# Altium project usb_ir.PRJPCB
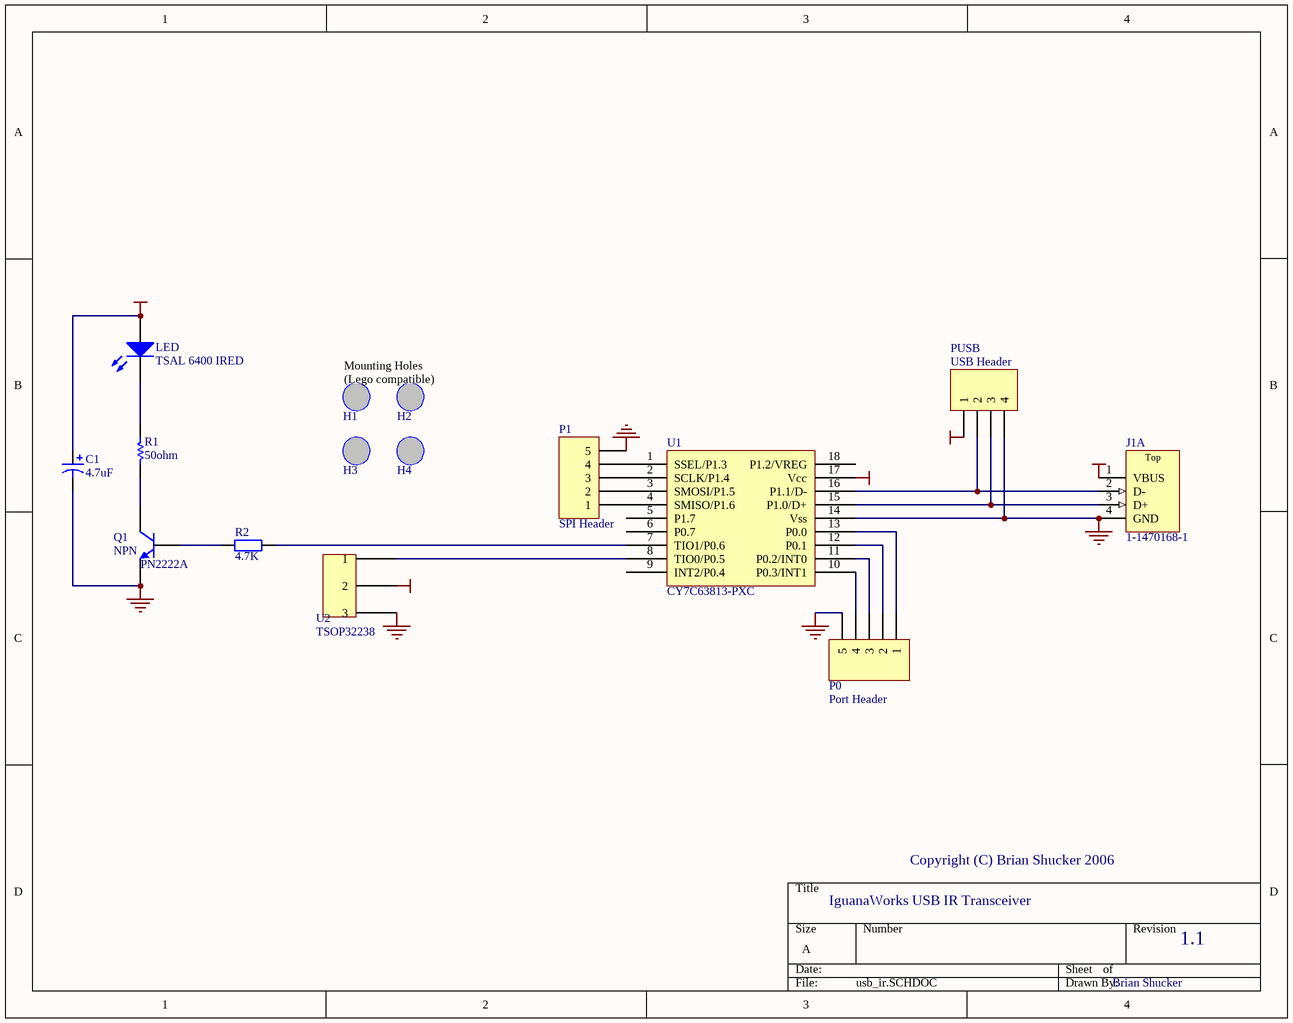
[diagram p0: usb_ir.SCHDOC]
1 sheet, 15 parts. Net scope: global (net labels, ports and power ports of the same name join across sheets).
Board file: usb_ir.PCBDOC

## Sheet usb_ir.SCHDOC
size A

### Parts
C1  value 4.7uF  [CAPPR2-5x6.8]  (hidden comment: Cap Pol1)
H1  Lego Hole  [Lego Hole]  (value not drawn)
H2  Lego Hole  [Lego Hole]  (value not drawn)
H3  Lego Hole  [Lego Hole]  (value not drawn)
H4  Lego Hole  [Lego Hole]  (value not drawn)
J1  1-1470168-1  [1470695A]  (part A of 3)
LED  TSAL 6400 IRED  [LED]
P0  Port Header  [HDR1X5]
P1  SPI Header  [HDR1X5]
PUSB  USB Header  [HDR1X4]
Q1  NPN  [TO-92]
R1  50ohm  [AXIAL-0.4]
R2  value 4.7K  [AXIAL-0.4]  (hidden comment: Res2)
U1  CY7C63813-PXC  [DIP-18]
U2  TSOP32238  [vishay1]

### Nets
GND: C1.2 J1.4(GND) P0.5 P1.5 PUSB.4 Q1.3(E) U1.14(Vss) U2.3
VCC: C1.1 J1.1(VBUS) LED.1(A) PUSB.1 U1.17(Vcc) U2.2
NetJ1_2: J1.2(D-) PUSB.2 U1.16(P1.1/D-)
NetJ1_3: J1.3(D+) PUSB.3 U1.15(P1.0/D+)
NetLED_2: LED.2(K) R1.2
NetP0_1: P0.1 U1.13(P0.0)
NetP0_2: P0.2 U1.12(P0.1)
NetP0_3: P0.3 U1.11(P0.2/INT0)
NetP0_4: P0.4 U1.10(P0.3/INT1)
NetP1_1: P1.1 U1.4(SMISO/P1.6)
NetP1_2: P1.2 U1.3(SMOSI/P1.5)
NetP1_3: P1.3 U1.2(SCLK/P1.4)
NetP1_4: P1.4 U1.1(SSEL/P1.3)
NetQ1_1: Q1.1(C) R1.1
NetQ1_2: Q1.2(B) R2.2
NetR2_1: R2.1 U1.7(TIO1/P0.6)
NetU1_8: U1.8(TIO0/P0.5) U2.1

Not connected (* = marked no-connect by the designer): U1 5(P1.7) 6(P0.7) 9(INT2/P0.4) 18(P1.2/VREG)

### Notes on the sheet
- Mounting Holes
  (Lego compatible)
- (near Q1) PN2222A
- IguanaWorks USB IR Transceiver
- Copyright (C) Brian Shucker 2006
- 1.1
- Brian Shucker
- (in symbol 1-1470168-1, part A) Top

### Library data of the parts
C1 = Cap Pol1: Polarized Capacitor (Radial); Published: 8-Jun-2000; LatestRevisionDate: 17-Jul-2002; LatestRevisionNote: Re-released for DXP Platform.; Publisher: Altium Limited
H1-H4 = Lego Hole: Standard lego-size mounting hole
J1 = 1-1470168-1: USB 1.1, Right Angle, Thru-Hole, A Type, Receptacle, 4x4 Position, Stacked, Black; ContactMaterial: Copper Alloy; ContactPlating: Gold Flash; TerminationLength: 3.18mm [0.125in.]; PCB_Layout: Complies with manufacturer's recommendation.; DrillSize: Corresponds to nominal value.; PanelGround: With; Published: 15-Jul-2004; DatasheetDocument: 15-Aug-2002; PackageDocument: 15-Aug-2002; PackageReference: 1470168; Publisher: Altium Limited; HousingMaterial: Glass-Filled Thermoplastic
LED = LED0: Typical INFRARED GaAs LED; Published: 8-Jun-2000; LatestRevisionDate: 17-Jul-2002; LatestRevisionNote: Re-released for DXP Platform.; Publisher: Altium Limited
P0 P1 = Header 5: Header, 5-Pin; LatestRevisionDate: 17-Jul-2002; LatestRevisionNote: Re-released for DXP Platform.; Publisher: Altium Limited
PUSB = Header 4: Header, 4-Pin; LatestRevisionDate: 17-Jul-2002; LatestRevisionNote: Re-released for DXP Platform.; Publisher: Altium Limited
Q1 = NPN: NPN Bipolar Transistor; pin to pad: 1>3 3>1; Published: 8-Jun-2000; LatestRevisionDate: 17-Jul-2002; LatestRevisionNote: Re-released for DXP Platform.; Publisher: Altium Limited; Code_JEDEC: TO-226-AA
R1 = Res Semi: Semiconductor Resistor; Published: 8-Jun-2000; LatestRevisionDate: 17-Jul-2002; LatestRevisionNote: Re-released for DXP Platform.; Publisher: Altium Limited; Value: 50ohm
R2 = Res2: Resistor; Published: 8-Jun-2000; LatestRevisionDate: 17-Jul-2002; LatestRevisionNote: Re-released for DXP Platform.; Publisher: Altium Limited
U1 = CY7C63813-PXC: USB microcontroller
U2 = TSOP2238 IR RECEIVER MODULE